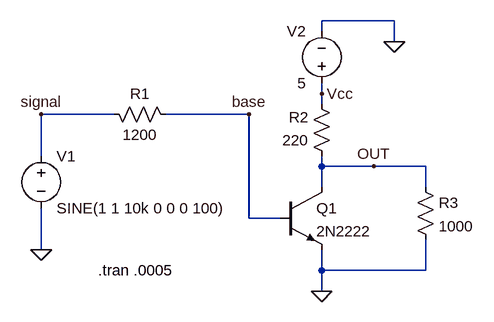
[diagram p0: schematic npn.asc]
npn.asc, the LTspice schematic file:
Version 4
SHEET 1 880 680
WIRE 640 -96 528 -96
WIRE 528 -80 528 -96
WIRE 640 -64 640 -96
WIRE 528 16 528 0
WIRE 528 32 528 16
WIRE 208 48 96 48
WIRE 416 48 288 48
WIRE 96 112 96 48
WIRE 528 128 528 112
WIRE 608 128 528 128
WIRE 688 128 608 128
WIRE 528 160 528 128
WIRE 688 160 688 128
WIRE 416 208 416 48
WIRE 464 208 416 208
WIRE 96 256 96 192
WIRE 528 288 528 256
WIRE 688 288 688 240
WIRE 688 288 528 288
WIRE 528 320 528 288
FLAG 96 256 0
FLAG 528 320 0
FLAG 640 -64 0
FLAG 608 128 OUT
FLAG 96 48 signal
FLAG 416 48 base
FLAG 528 16 Vcc
SYMBOL voltage 96 96 R0
WINDOW 123 0 0 Left 0
WINDOW 39 0 0 Left 0
SYMATTR InstName V1
SYMATTR Value SINE(1 1 10k 0 0 0 100)
SYMBOL res 192 32 M90
WINDOW 0 0 56 VBottom 2
WINDOW 3 32 56 VTop 2
SYMATTR InstName R1
SYMATTR Value 1200
SYMBOL npn 464 160 R0
SYMATTR InstName Q1
SYMATTR Value 2N2222
SYMBOL voltage 528 16 R180
WINDOW 0 24 96 Left 2
WINDOW 3 24 16 Left 2
WINDOW 123 0 0 Left 0
WINDOW 39 0 0 Left 0
SYMATTR InstName V2
SYMATTR Value 5
SYMBOL res 544 128 R180
WINDOW 0 36 76 Left 2
WINDOW 3 36 40 Left 2
SYMATTR InstName R2
SYMATTR Value 220
SYMBOL res 672 144 R0
SYMATTR InstName R3
SYMATTR Value 1000
TEXT 184 288 Left 2 !.tran .0005

The netlist it stands for:
* npn.asc
V1 signal 0 SINE(1 1 10k 0 0 0 100)
R1 signal base 1200
Q1 OUT base 0 0 2N2222
V2 Vcc 0 5
R2 OUT Vcc 220
R3 OUT 0 1000
.model NPN NPN
.model PNP PNP
.lib standard.bjt
.tran .0005
.backanno
.end